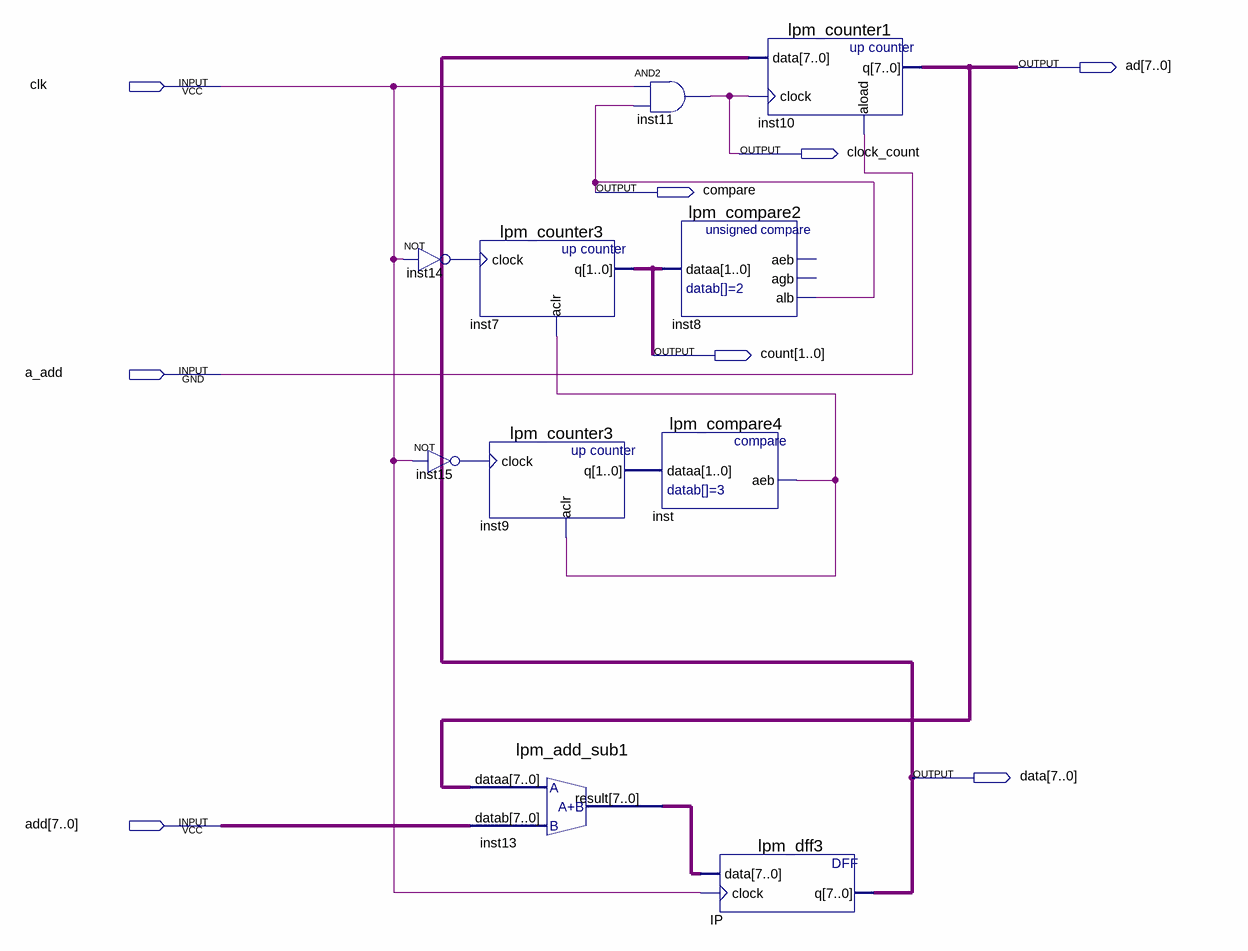
[diagram p0: schematic sheet]
// Quartus schematic test.bdf as structural Verilog: 10 symbols, 8 pins
module test (
  input  clk,
  input  a_add,
  input  [7:0] add,
  output [7:0] ad,
  output clock_count,
  output compare,
  output [1:0] count,
  output [7:0] data
);

  wire inst14_out, inst15_out, inst_aeb;
  wire [1:0] inst9_q;
  wire [7:0] inst13_result;

  not inst14 (inst14_out, clk);
  lpm_counter3 inst7 (.clock(inst14_out), .aclr(inst_aeb), .q(count));
  lpm_counter3 inst9 (.clock(inst15_out), .aclr(inst_aeb), .q(inst9_q));
  not inst15 (inst15_out, clk);
  lpm_add_sub1 inst13 (.dataa(ad), .datab(add), .result(inst13_result));
  and inst11 (clock_count, clk, compare);
  lpm_compare2 inst8 (.dataa(count), .alb(compare));  // open: aeb, agb
  lpm_compare4 inst (.dataa(inst9_q), .aeb(inst_aeb));
  lpm_dff3 IP (.data(inst13_result), .clock(clk), .q(data));
  lpm_counter1 inst10 (.data(data), .clock(clock_count), .aload(a_add), .q(ad));
endmodule
